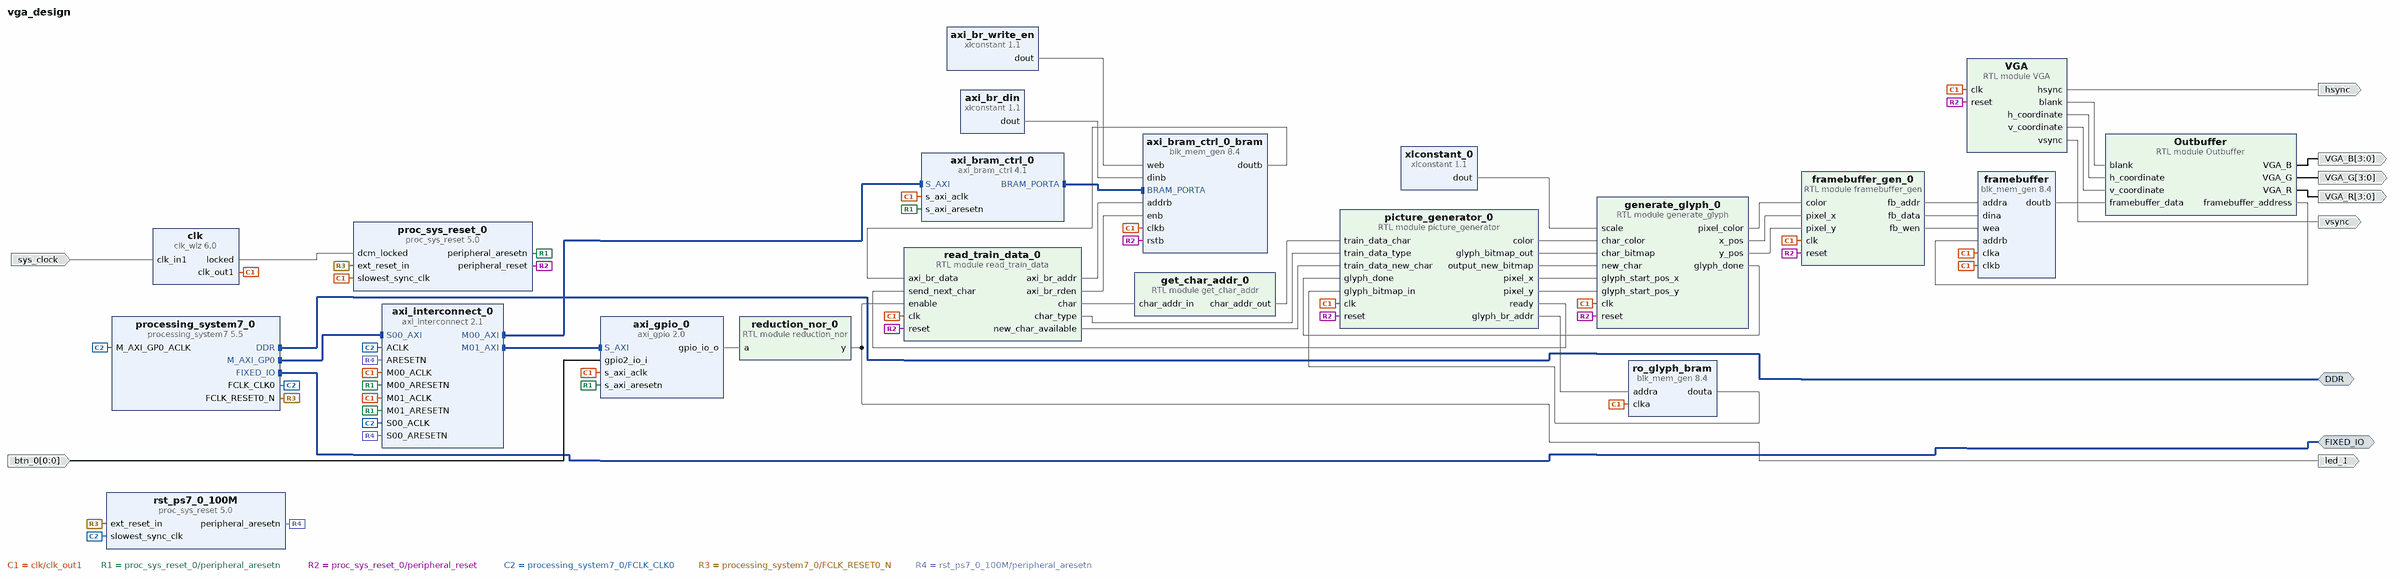
[diagram p0: block diagram of the top level]
# Vivado block design vga_design, xc7z020clg484-1, Vivado 2022.2
create_bd_design vga_design

create_bd_intf_port -mode Master -vlnv xilinx.com:interface:ddrx_rtl:1.0 DDR
create_bd_intf_port -mode Master -vlnv xilinx.com:display_processing_system7:fixedio_rtl:1.0 FIXED_IO
create_bd_port -dir I -type clk sys_clock
create_bd_port -dir O hsync
create_bd_port -dir O vsync
create_bd_port -dir O -from 3 -to 0 VGA_R
create_bd_port -dir O -from 3 -to 0 VGA_G
create_bd_port -dir O -from 3 -to 0 VGA_B
create_bd_port -dir O led_1
create_bd_port -dir I -from 0 -to 0 btn_0

create_bd_cell -type ip -vlnv xilinx.com:ip:clk_wiz:6.0 clk
set_property -dict [list \
  CONFIG.CLKOUT1_JITTER 319.783 \
  CONFIG.CLKOUT1_PHASE_ERROR 246.739 \
  CONFIG.CLKOUT1_REQUESTED_OUT_FREQ 25.175 \
  CONFIG.MMCM_CLKFBOUT_MULT_F 36.375 \
  CONFIG.MMCM_CLKOUT0_DIVIDE_F 36.125 \
  CONFIG.MMCM_DIVCLK_DIVIDE 4 \
  CONFIG.USE_RESET false \
] [get_bd_cells clk]
create_bd_cell -type ip -vlnv xilinx.com:ip:proc_sys_reset:5.0 proc_sys_reset_0
create_bd_cell -type ip -vlnv xilinx.com:ip:processing_system7:5.5 processing_system7_0
set_property -dict [list \
  CONFIG.PCW_APU_PERIPHERAL_FREQMHZ 666.666667 \
  CONFIG.PCW_ENET0_ENET0_IO {MIO 16 .. 27} \
  CONFIG.PCW_ENET0_GRP_MDIO_ENABLE 1 \
  CONFIG.PCW_ENET0_GRP_MDIO_IO {MIO 52 .. 53} \
  CONFIG.PCW_ENET0_PERIPHERAL_ENABLE 1 \
  CONFIG.PCW_ENET0_RESET_ENABLE 0 \
  CONFIG.PCW_ENET_RESET_ENABLE 1 \
  CONFIG.PCW_ENET_RESET_SELECT {Share reset pin} \
  CONFIG.PCW_FPGA0_PERIPHERAL_FREQMHZ 100.000000 \
  CONFIG.PCW_FPGA1_PERIPHERAL_FREQMHZ 150.000000 \
  CONFIG.PCW_GPIO_MIO_GPIO_ENABLE 1 \
  CONFIG.PCW_GPIO_MIO_GPIO_IO MIO \
  CONFIG.PCW_I2C_RESET_ENABLE 1 \
  CONFIG.PCW_PRESET_BANK1_VOLTAGE {LVCMOS 1.8V} \
  CONFIG.PCW_QSPI_GRP_SINGLE_SS_ENABLE 1 \
  CONFIG.PCW_QSPI_GRP_SINGLE_SS_IO {MIO 1 .. 6} \
  CONFIG.PCW_QSPI_PERIPHERAL_ENABLE 1 \
  CONFIG.PCW_QSPI_QSPI_IO {MIO 1 .. 6} \
  CONFIG.PCW_SD0_GRP_CD_ENABLE 1 \
  CONFIG.PCW_SD0_GRP_CD_IO {MIO 47} \
  CONFIG.PCW_SD0_GRP_WP_ENABLE 1 \
  CONFIG.PCW_SD0_GRP_WP_IO {MIO 46} \
  CONFIG.PCW_SD0_PERIPHERAL_ENABLE 1 \
  CONFIG.PCW_SD0_SD0_IO {MIO 40 .. 45} \
  CONFIG.PCW_SDIO_PERIPHERAL_FREQMHZ 50 \
  CONFIG.PCW_SINGLE_QSPI_DATA_MODE x4 \
  CONFIG.PCW_TTC0_PERIPHERAL_ENABLE 1 \
  CONFIG.PCW_TTC0_TTC0_IO EMIO \
  CONFIG.PCW_UART1_PERIPHERAL_ENABLE 1 \
  CONFIG.PCW_UART1_UART1_IO {MIO 48 .. 49} \
  CONFIG.PCW_UART_PERIPHERAL_FREQMHZ 50 \
  CONFIG.PCW_UIPARAM_DDR_FREQ_MHZ 533.333313 \
  CONFIG.PCW_UIPARAM_DDR_PARTNO {MT41J128M16 HA-15E} \
  CONFIG.PCW_USB0_PERIPHERAL_ENABLE 1 \
  CONFIG.PCW_USB0_RESET_ENABLE 0 \
  CONFIG.PCW_USB0_USB0_IO {MIO 28 .. 39} \
  CONFIG.PCW_USB_RESET_ENABLE 1 \
  CONFIG.PCW_USB_RESET_SELECT {Share reset pin} \
  CONFIG.preset ZedBoard \
] [get_bd_cells processing_system7_0]
# 223 more settings of processing_system7_0 are not shown: defaults, MIO pin electricals, DDR timing, and values the tool derives
create_bd_cell -type ip -vlnv xilinx.com:ip:blk_mem_gen:8.4 framebuffer
set_property -dict [list \
  CONFIG.Disable_Collision_Warnings true \
  CONFIG.Enable_A Always_Enabled \
  CONFIG.Enable_B Always_Enabled \
  CONFIG.Fill_Remaining_Memory_Locations true \
  CONFIG.Load_Init_File false \
  CONFIG.Memory_Type Simple_Dual_Port_RAM \
  CONFIG.Register_PortB_Output_of_Memory_Primitives false \
  CONFIG.Remaining_Memory_Locations 000 \
  CONFIG.Write_Depth_A 307200 \
  CONFIG.Write_Width_A 12 \
  CONFIG.use_bram_block Stand_Alone \
] [get_bd_cells framebuffer]
create_bd_cell -type ip -vlnv xilinx.com:ip:blk_mem_gen:8.4 ro_glyph_bram
set_property -dict [list \
  CONFIG.Coe_File ../../../../Lat7-Terminus16.coe \
  CONFIG.Enable_A Always_Enabled \
  CONFIG.Load_Init_File true \
  CONFIG.Memory_Type Single_Port_ROM \
  CONFIG.Register_PortA_Output_of_Memory_Primitives false \
  CONFIG.Write_Depth_A 256 \
  CONFIG.Write_Width_A 128 \
  CONFIG.use_bram_block Stand_Alone \
] [get_bd_cells ro_glyph_bram]
create_bd_cell -type ip -vlnv xilinx.com:ip:axi_bram_ctrl:4.1 axi_bram_ctrl_0
set_property -dict {CONFIG.PROTOCOL AXI4 CONFIG.SINGLE_PORT_BRAM 1} [get_bd_cells axi_bram_ctrl_0]
create_bd_cell -type ip -vlnv xilinx.com:ip:blk_mem_gen:8.4 axi_bram_ctrl_0_bram
set_property -dict [list \
  CONFIG.Enable_B Use_ENB_Pin \
  CONFIG.Memory_Type True_Dual_Port_RAM \
  CONFIG.use_bram_block BRAM_Controller \
] [get_bd_cells axi_bram_ctrl_0_bram]
create_bd_cell -type ip -vlnv xilinx.com:ip:proc_sys_reset:5.0 rst_ps7_0_100M
create_bd_cell -type ip -vlnv xilinx.com:ip:xlconstant:1.1 xlconstant_0
set_property -dict {CONFIG.CONST_VAL 00 CONFIG.CONST_WIDTH 2} [get_bd_cells xlconstant_0]
create_bd_cell -type ip -vlnv xilinx.com:ip:axi_interconnect:2.1 axi_interconnect_0
create_bd_cell -type ip -vlnv xilinx.com:ip:axi_gpio:2.0 axi_gpio_0
set_property -dict [list \
  CONFIG.C_ALL_INPUTS_2 1 \
  CONFIG.C_ALL_OUTPUTS 1 \
  CONFIG.C_GPIO2_WIDTH 1 \
  CONFIG.C_GPIO_WIDTH 1 \
  CONFIG.C_IS_DUAL 1 \
  CONFIG.GPIO_BOARD_INTERFACE Custom \
  CONFIG.USE_BOARD_FLOW true \
] [get_bd_cells axi_gpio_0]
create_bd_cell -type ip -vlnv xilinx.com:ip:xlconstant:1.1 axi_br_write_en
set_property -dict {CONFIG.CONST_VAL 0 CONFIG.CONST_WIDTH 4} [get_bd_cells axi_br_write_en]
create_bd_cell -type ip -vlnv xilinx.com:ip:xlconstant:1.1 axi_br_din
set_property -dict {CONFIG.CONST_VAL 0 CONFIG.CONST_WIDTH 32} [get_bd_cells axi_br_din]
create_bd_cell -type module -reference VGA VGA
set_property -dict [list \
  CONFIG.h_back_porch 48 \
  CONFIG.h_coordinate_width 10 \
  CONFIG.h_front_porch 16 \
  CONFIG.h_sync 96 \
  CONFIG.h_visible_area 640 \
  CONFIG.v_back_porch 33 \
  CONFIG.v_coordinate_width 10 \
  CONFIG.v_front_porch 10 \
  CONFIG.v_sync 2 \
  CONFIG.v_visible_area 480 \
] [get_bd_cells VGA]
create_bd_cell -type module -reference framebuffer_gen framebuffer_gen_0
create_bd_cell -type module -reference Outbuffer Outbuffer
set_property -dict {CONFIG.h_coordinate_width 10 CONFIG.v_coordinate_width 10} [get_bd_cells Outbuffer]
create_bd_cell -type module -reference reduction_nor reduction_nor_0
set_property -dict {CONFIG.N 1} [get_bd_cells reduction_nor_0]
create_bd_cell -type module -reference generate_glyph generate_glyph_0
create_bd_cell -type module -reference get_char_addr get_char_addr_0
create_bd_cell -type module -reference picture_generator picture_generator_0
create_bd_cell -type module -reference read_train_data read_train_data_0
set_property -dict {CONFIG.BRAM_ADDR_WIDTH 32 CONFIG.BRAM_LAST_ADDR 2400} [get_bd_cells read_train_data_0]

# ---- connections ----

connect_bd_intf_net [get_bd_intf_pins axi_bram_ctrl_0_bram/BRAM_PORTA] [get_bd_intf_pins axi_bram_ctrl_0/BRAM_PORTA]
connect_bd_intf_net [get_bd_intf_pins axi_interconnect_0/M00_AXI] [get_bd_intf_pins axi_bram_ctrl_0/S_AXI]
connect_bd_intf_net [get_bd_intf_pins axi_interconnect_0/M01_AXI] [get_bd_intf_pins axi_gpio_0/S_AXI]
connect_bd_intf_net [get_bd_intf_ports DDR] [get_bd_intf_pins processing_system7_0/DDR]
connect_bd_intf_net [get_bd_intf_ports FIXED_IO] [get_bd_intf_pins processing_system7_0/FIXED_IO]
connect_bd_intf_net [get_bd_intf_pins processing_system7_0/M_AXI_GP0] [get_bd_intf_pins axi_interconnect_0/S00_AXI]
connect_bd_net [get_bd_pins clk/clk_out1] \
  [get_bd_pins framebuffer/clkb] [get_bd_pins proc_sys_reset_0/slowest_sync_clk] [get_bd_pins ro_glyph_bram/clka] \
  [get_bd_pins framebuffer/clka] [get_bd_pins axi_bram_ctrl_0_bram/clkb] [get_bd_pins axi_interconnect_0/M00_ACLK] \
  [get_bd_pins axi_interconnect_0/M01_ACLK] [get_bd_pins axi_gpio_0/s_axi_aclk] [get_bd_pins axi_bram_ctrl_0/s_axi_aclk] \
  [get_bd_pins VGA/clk] [get_bd_pins framebuffer_gen_0/clk] [get_bd_pins generate_glyph_0/clk] \
  [get_bd_pins picture_generator_0/clk] [get_bd_pins read_train_data_0/clk]
connect_bd_net [get_bd_pins Outbuffer/VGA_B] [get_bd_ports VGA_B]
connect_bd_net [get_bd_pins Outbuffer/VGA_G] [get_bd_ports VGA_G]
connect_bd_net [get_bd_pins Outbuffer/VGA_R] [get_bd_ports VGA_R]
connect_bd_net [get_bd_pins Outbuffer/framebuffer_address] [get_bd_pins framebuffer/addrb]
connect_bd_net -net VGA_0_vsync [get_bd_pins VGA/vsync] [get_bd_ports vsync]
connect_bd_net [get_bd_pins VGA/blank] [get_bd_pins Outbuffer/blank]
connect_bd_net [get_bd_pins VGA/h_coordinate] [get_bd_pins Outbuffer/h_coordinate]
connect_bd_net [get_bd_pins VGA/hsync] [get_bd_ports hsync]
connect_bd_net [get_bd_pins VGA/v_coordinate] [get_bd_pins Outbuffer/v_coordinate]
connect_bd_net [get_bd_pins axi_bram_ctrl_0_bram/doutb] [get_bd_pins read_train_data_0/axi_br_data]
connect_bd_net [get_bd_pins axi_gpio_0/gpio_io_o] [get_bd_pins reduction_nor_0/a]
connect_bd_net -net clk_in1_0_1 [get_bd_ports sys_clock] [get_bd_pins clk/clk_in1]
connect_bd_net [get_bd_pins clk/locked] [get_bd_pins proc_sys_reset_0/dcm_locked]
connect_bd_net [get_bd_pins framebuffer/doutb] [get_bd_pins Outbuffer/framebuffer_data]
connect_bd_net [get_bd_pins framebuffer_gen_0/fb_addr] [get_bd_pins framebuffer/addra]
connect_bd_net [get_bd_pins framebuffer_gen_0/fb_data] [get_bd_pins framebuffer/dina]
connect_bd_net [get_bd_pins framebuffer_gen_0/fb_wen] [get_bd_pins framebuffer/wea]
connect_bd_net [get_bd_pins generate_glyph_0/glyph_done] [get_bd_pins picture_generator_0/glyph_done]
connect_bd_net [get_bd_pins generate_glyph_0/pixel_color] [get_bd_pins framebuffer_gen_0/color]
connect_bd_net [get_bd_pins generate_glyph_0/x_pos] [get_bd_pins framebuffer_gen_0/pixel_x]
connect_bd_net [get_bd_pins generate_glyph_0/y_pos] [get_bd_pins framebuffer_gen_0/pixel_y]
connect_bd_net [get_bd_pins get_char_addr_0/char_addr_out] [get_bd_pins picture_generator_0/train_data_char]
connect_bd_net -net gpio2_io_i_0_1 [get_bd_ports btn_0] [get_bd_pins axi_gpio_0/gpio2_io_i]
connect_bd_net [get_bd_pins picture_generator_0/color] [get_bd_pins generate_glyph_0/char_color]
connect_bd_net [get_bd_pins picture_generator_0/glyph_bitmap_out] [get_bd_pins generate_glyph_0/char_bitmap]
connect_bd_net [get_bd_pins picture_generator_0/glyph_br_addr] [get_bd_pins ro_glyph_bram/addra]
connect_bd_net [get_bd_pins picture_generator_0/output_new_bitmap] [get_bd_pins generate_glyph_0/new_char]
connect_bd_net [get_bd_pins picture_generator_0/pixel_x] [get_bd_pins generate_glyph_0/glyph_start_pos_x]
connect_bd_net [get_bd_pins picture_generator_0/pixel_y] [get_bd_pins generate_glyph_0/glyph_start_pos_y]
connect_bd_net [get_bd_pins picture_generator_0/ready] [get_bd_pins read_train_data_0/send_next_char]
connect_bd_net [get_bd_pins proc_sys_reset_0/peripheral_aresetn] \
  [get_bd_pins axi_gpio_0/s_axi_aresetn] [get_bd_pins axi_bram_ctrl_0/s_axi_aresetn] \
  [get_bd_pins axi_interconnect_0/M00_ARESETN] [get_bd_pins axi_interconnect_0/M01_ARESETN]
connect_bd_net [get_bd_pins proc_sys_reset_0/peripheral_reset] \
  [get_bd_pins axi_bram_ctrl_0_bram/rstb] [get_bd_pins VGA/reset] [get_bd_pins framebuffer_gen_0/reset] \
  [get_bd_pins generate_glyph_0/reset] [get_bd_pins picture_generator_0/reset] [get_bd_pins read_train_data_0/reset]
connect_bd_net [get_bd_pins processing_system7_0/FCLK_CLK0] \
  [get_bd_pins processing_system7_0/M_AXI_GP0_ACLK] [get_bd_pins rst_ps7_0_100M/slowest_sync_clk] \
  [get_bd_pins axi_interconnect_0/ACLK] [get_bd_pins axi_interconnect_0/S00_ACLK]
connect_bd_net [get_bd_pins processing_system7_0/FCLK_RESET0_N] [get_bd_pins proc_sys_reset_0/ext_reset_in] [get_bd_pins rst_ps7_0_100M/ext_reset_in]
connect_bd_net [get_bd_pins read_train_data_0/axi_br_addr] [get_bd_pins axi_bram_ctrl_0_bram/addrb]
connect_bd_net [get_bd_pins read_train_data_0/axi_br_rden] [get_bd_pins axi_bram_ctrl_0_bram/enb]
connect_bd_net [get_bd_pins read_train_data_0/char] [get_bd_pins get_char_addr_0/char_addr_in]
connect_bd_net [get_bd_pins read_train_data_0/char_type] [get_bd_pins picture_generator_0/train_data_type]
connect_bd_net [get_bd_pins read_train_data_0/new_char_available] [get_bd_pins picture_generator_0/train_data_new_char]
connect_bd_net [get_bd_pins reduction_nor_0/y] [get_bd_ports led_1] [get_bd_pins read_train_data_0/enable]
connect_bd_net [get_bd_pins ro_glyph_bram/douta] [get_bd_pins picture_generator_0/glyph_bitmap_in]
connect_bd_net [get_bd_pins rst_ps7_0_100M/peripheral_aresetn] [get_bd_pins axi_interconnect_0/S00_ARESETN] [get_bd_pins axi_interconnect_0/ARESETN]
connect_bd_net [get_bd_pins xlconstant_0/dout] [get_bd_pins generate_glyph_0/scale]
connect_bd_net -net xlconstant_1_dout [get_bd_pins axi_br_write_en/dout] [get_bd_pins axi_bram_ctrl_0_bram/web]
connect_bd_net -net xlconstant_2_dout [get_bd_pins axi_br_din/dout] [get_bd_pins axi_bram_ctrl_0_bram/dinb]
set_property HDL_ATTRIBUTE.BMM_INFO_PROCESSOR {arm > vga_design axi_bram_ctrl_0} [get_bd_cells processing_system7_0]
set_property HDL_ATTRIBUTE.KEEP_HIERARCHY yes [get_bd_cells processing_system7_0]
set_property HDL_ATTRIBUTE.BMM_INFO_ADDRESS_SPACE {byte  0x40000000 32 > vga_design axi_bram_ctrl_0_bram} [get_bd_cells axi_bram_ctrl_0]
set_property HDL_ATTRIBUTE.KEEP_HIERARCHY yes [get_bd_cells axi_bram_ctrl_0]

# ---- address map ----
assign_bd_address -offset 0x40000000 -range 16K -target_address_space [get_bd_addr_spaces processing_system7_0/Data] [get_bd_addr_segs axi_bram_ctrl_0/S_AXI/Mem0]
assign_bd_address -offset 0x41200000 -range 64K -target_address_space [get_bd_addr_spaces processing_system7_0/Data] [get_bd_addr_segs axi_gpio_0/S_AXI/Reg]

validate_bd_design
save_bd_design
